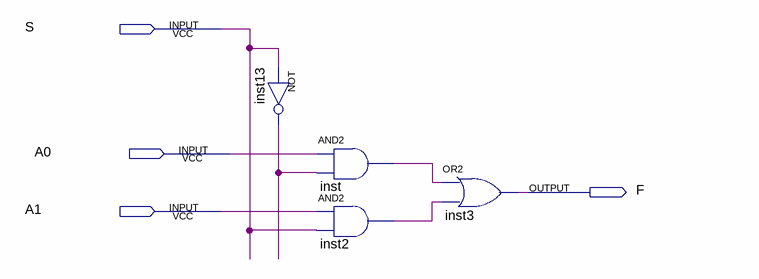
[diagram p0: schematic sheet]
// Quartus schematic mux_2x1_1bit.bdf as structural Verilog: 4 symbols, 4 pins
module mux_2x1_1bit (
  input  S,
  input  A0,
  input  A1,
  output F
);

  wire inst2_out, inst13_out, inst_out;

  not inst13 (inst13_out, S);
  and inst (inst_out, A0, inst13_out);
  and inst2 (inst2_out, A1, S);
  or inst3 (F, inst_out, inst2_out);
endmodule
